# Altium schematic sheet RoBeast_Mounting_Shield.SchDoc: Connectors & Shield
size A4; ApprovedBy: CR; DrawnBy: VM & IG; Revision: V1; SheetNumber: 1; SheetTotal: 9
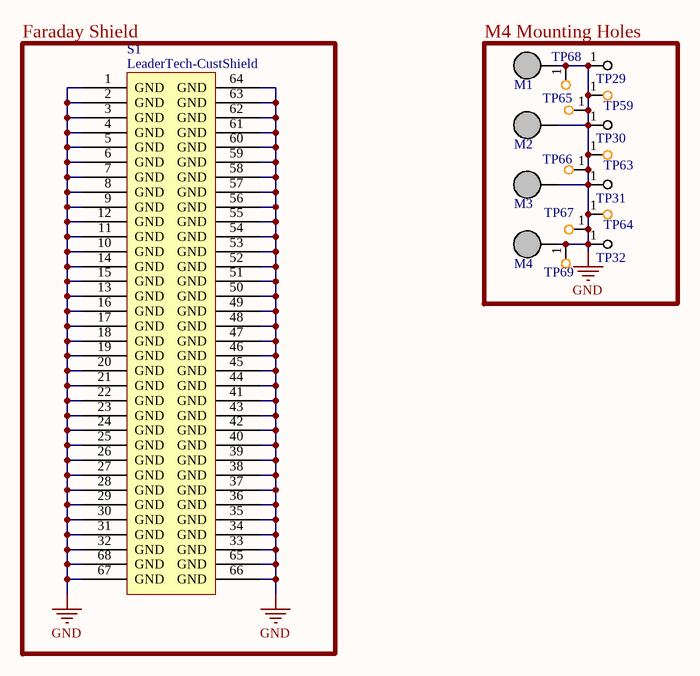
[diagram p0: RoBeast_Mounting_Shield.SchDoc]

## Parts
M1  M4 Mounting Screw Hole  [M4]  (value not drawn)
M2  M4 Mounting Screw Hole  [M4]  (value not drawn)
M3  M4 Mounting Screw Hole  [M4]  (value not drawn)
M4  M4 Mounting Screw Hole  [M4]  (value not drawn)
S1  LeaderTech-CustShield  [CMP-00028-00007-1]
TP29  Test Point  [RCWCTE]  (value not drawn)
TP30  Test Point  [RCWCTE]  (value not drawn)
TP31  Test Point  [RCWCTE]  (value not drawn)
TP32  Test Point  [RCWCTE]  (value not drawn)
TP59  Test Point  [Test Point]  (value not drawn)
TP63  Test Point  [Test Point]  (value not drawn)
TP64  Test Point  [Test Point]  (value not drawn)
TP65  Test Point  [Test Point]  (value not drawn)
TP66  Test Point  [Test Point]  (value not drawn)
TP67  Test Point  [Test Point]  (value not drawn)
TP68  Test Point  [Test Point]  (value not drawn)
TP69  Test Point  [Test Point]  (value not drawn)

## Blocks framed on the sheet
Faraday Shield: S1
M4 Mounting Holes: M1-M4 TP29-TP32 TP59 TP63-TP69

## Nets
GND: M1.1(M4) M2.1(M4) M3.1(M4) M4.1(M4) S1.1(GND) S1.2(GND) S1.3(GND) S1.4(GND) S1.5(GND) S1.6(GND) S1.7(GND) S1.8(GND) S1.9(GND) S1.10(GND) S1.11(GND) S1.12(GND) S1.13(GND) S1.14(GND) S1.15(GND) S1.16(GND) S1.17(GND) S1.18(GND) S1.19(GND) S1.20(GND) S1.21(GND) S1.22(GND) S1.23(GND) S1.24(GND) S1.25(GND) S1.26(GND) S1.27(GND) S1.28(GND) S1.29(GND) S1.30(GND) S1.31(GND) S1.32(GND) S1.33(GND) S1.34(GND) S1.35(GND) S1.36(GND) S1.37(GND) S1.38(GND) S1.39(GND) S1.40(GND) S1.41(GND) S1.42(GND) S1.43(GND) S1.44(GND) S1.45(GND) S1.46(GND) S1.47(GND) S1.48(GND) S1.49(GND) S1.50(GND) S1.51(GND) S1.52(GND) S1.53(GND) S1.54(GND) S1.55(GND) S1.56(GND) S1.57(GND) S1.58(GND) S1.59(GND) S1.60(GND) S1.61(GND) S1.62(GND) S1.63(GND) S1.64(GND) S1.65(GND) S1.66(GND) S1.67(GND) S1.68(GND) TP29.1 TP30.1 TP31.1 TP32.1 TP59.1 TP63.1 TP64.1 TP65.1 TP66.1 TP67.1 TP68.1 TP69.1

## Library data of the parts
M1-M4 = M4
S1 = CMP-00028-00007-1
TP29-TP32 = RCWCTE: Testing/Accessories; Manufacturer: KOA Speer; Rated Temperature: 70°C; Resistance: 0R; Package Height: 2mm; Package Length: 3.2mm; Package Width: 1.6mm; Reference Standard: AEC-Q200; Supplier 1: Digikey; Manufacturer Part Number: RCWCTE; RoHS: Yes; Category: Chip SMD Resistors; Stock 1: 132357; Pricing 1: 1=0.16, 10=0.137, 25=0.1212, 50=0.1132, 100=0.105, 250=0.09292, 500=0.08888, 1000=0.07272 (USD); Mount: Surface Mount; Number of Pins: 2; Package Shape: Rectangular; Size Code: 1206; Terminal Finish: Copper; Min Operating Temperature: -55°C; Max Operating Temperature: 125°C; JESD-609 Code: e2; Resistor Type: FIXED RESISTOR; Construction: Chip; Package Style: SMTMeter; Packaging: Tape and Reel; Termination: Wraparound; Reach SVHC Compliant: Yes; RoHS Compliant: Yes; ComponentLink1URL: https://datasheet.ciiva.com:443/pdfs/VipMasterIC/IC/KOAS/KOASS03065/KOASS03065-1.pdf?src-supplier=IHS+Markit; ComponentLink1Description: https://datasheet.ciiva.com:443/pdfs/VipMasterIC/IC/KOAS/KOASS03065/KOASS03065-1.pdf?src-supplier=IHS+Markit; ComponentLink2URL: https://datasheet.ciiva.com/34302/1876186-34302940.pdf?src-supplier=Jameco; ComponentLink2Description: https://datasheet.ciiva.com/34302/1876186-34302940.pdf?src-supplier=Jameco; ComponentLink3URL: https://datasheet.ciiva.com/5556/rc-5556236.pdf?src-supplier=Mouser; ComponentLink3Description: https://datasheet.ciiva.com/5556/rc-5556236.pdf?src-supplier=Mouser; ComponentLink4URL: https://datasheet.ciiva.com/26821/getdatasheetpartid-110197-26821157.pdf?src-supplier=Verical; ComponentLink4Description: https://datasheet.ciiva.com/26821/getdatasheetpartid-110197-26821157.pdf?src-supplier=Verical; Supplier Part Number 1: 2019-RCWCTECT-ND